# EAGLE design LeoPhiv4 (EAGLE 6.2)
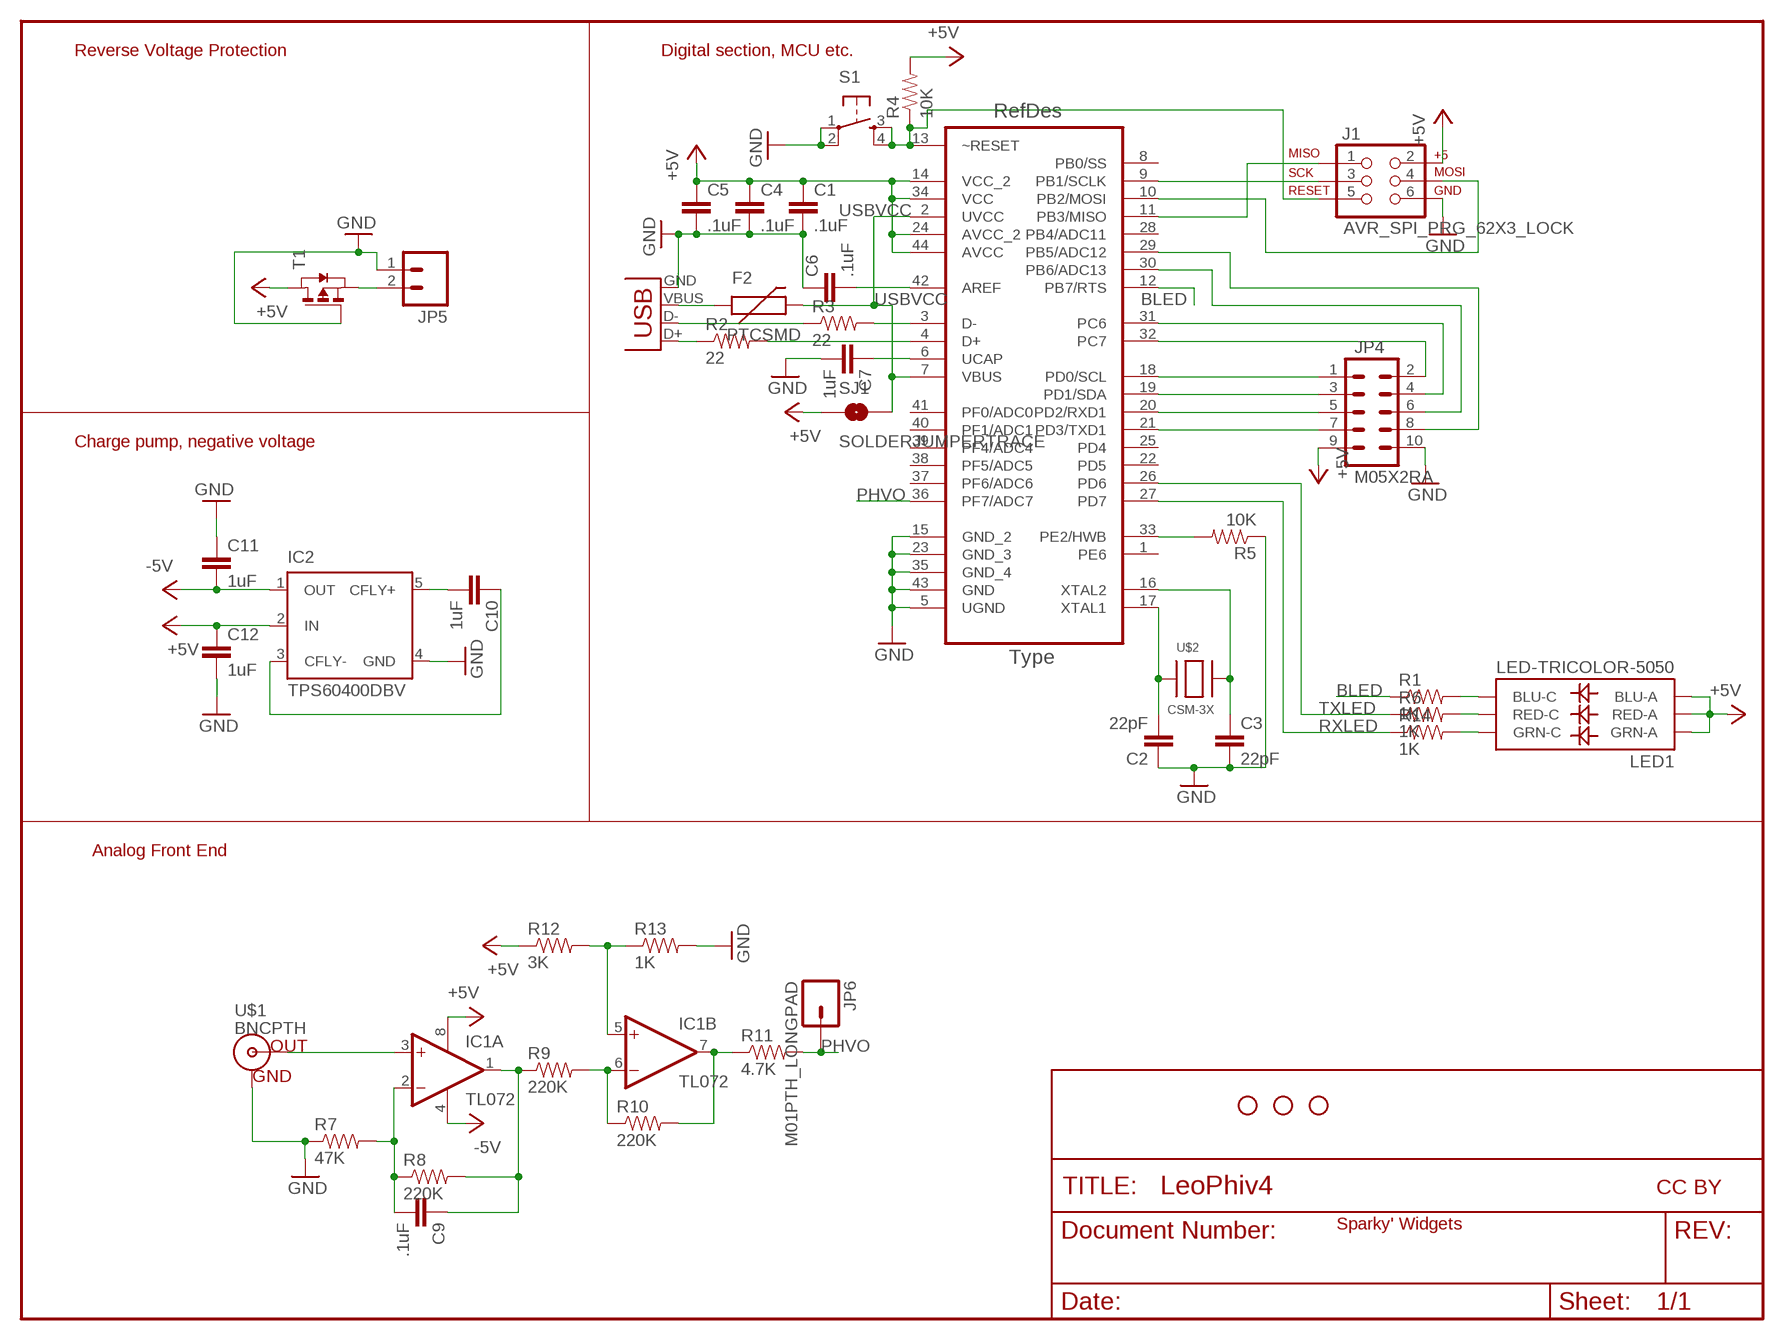
[diagram p0: schematic, sheet 1]

## Parts
C1  .1uF  CAP0805  [0805]
C2  22pF  CAP0805  [0805]
C3  22pF  CAP0805  [0805]
C4  .1uF  CAP0805  [0805]
C5  .1uF  CAP0805  [0805]
C6  .1uF  CAP0805  [0805]
C7  1uF  CAP0805  [0805]
C9  .1uF  CAP0805  [0805]
C10  1uF  CAP0805  [0805]
C11  1uF  CAP0805  [0805]
C12  1uF  CAP0805  [0805]
F2  PTCSMD  [PTC-1206]
IC1  TL072  LM358D  [SO08]
IC2  TPS60400DBV  [SOT23-DBV]
J1  AVR_SPI_PRG_62X3_LOCK  [2X3_LOCK]
JP1  STAND-OFF  [STAND-OFF]
JP2  STAND-OFF  [STAND-OFF]
JP3  STAND-OFF  [STAND-OFF]
JP4  M05X2RA  [2X5-RA]
JP5  M02POLAR  [MOLEX-1X2]
JP6  M01PTH_LONGPAD  [1X01_LONGPAD]
LED1  LED-TRICOLOR-5050  [LED-TRICOLOR-5050]
R1  1K  RESISTOR0805-RES  [0805]
R2  22  RESISTOR0805-RES  [0805]
R3  22  RESISTOR0805-RES  [0805]
R4  10K  RESISTOR0805-RES  [0805]
R5  10K  RESISTOR0805-RES  [0805]
R6  1K  RESISTOR0805-RES  [0805]
R7  47K  RESISTOR0805-RES  [0805]
R8  220K  RESISTOR0805-RES  [0805]
R9  220K  RESISTOR0805-RES  [0805]
R10  220K  RESISTOR0805-RES  [0805]
R11  4.7K  RESISTOR0805-RES  [0805]
R12  3K  RESISTOR0805-RES  [0805]
R13  1K  RESISTOR0805-RES  [0805]
R14  1K  RESISTOR0805-RES  [0805]
S1  TAC_SWITCHSMD  [TACTILE_SWITCH_SMD]
SJ1  SOLDERJUMPERTRACE  [SJ_2S-TRACE]
T1  PMOSSOT23  [SOT-23]
U1  ATMEGA32U4-AU  [QFP80P1200X1200X120-44N]
U$1  BNCPTH  [BNC]
U$2  CSM-3X  [XTALCSM3X]
X1  USBSMD  [USB-MINIB]

## Nets
+5V: C1.1 C4.1 C5.1 C12.1 IC1.8(P:V+) IC2.2(IN) J1.2 JP4.9 LED1.1(GRN-A) LED1.2(RED-A) LED1.3(BLU-A) R4.2 R12.1 SJ1.1 T1.1(D) U1.14(VCC_2) U1.24(AVCC_2) U1.34(VCC) U1.44(AVCC)
-5V: C11.2 IC1.4(P:V-) IC2.1(OUT)
AREF: C6.2 U1.42(AREF)
BLED: R1.1 U1.12(PB7/RTS)
GND: C1.2 C2.1 C3.2 C4.2 C5.2 C6.1 C7.2 C11.1 C12.2 IC2.4(GND) J1.6 JP4.10 JP5.1 R5.1 R7.1 R13.2 S1.1 S1.2 T1.3(G) U1.5(UGND) U1.15(GND_2) U1.23(GND_3) U1.35(GND_4) U1.43(GND) U$1.GND X1.GND
N$1: IC1.5(B:+IN) R12.2 R13.1
N$2: IC1.7(B:OUT) R10.2 R11.1
N$3: IC1.6(B:-IN) R9.2 R10.1
N$4: C2.2 U1.17(XTAL1) U$2.1
N$5: JP4.2 U1.32(PC7)
N$6: C3.1 U1.16(XTAL2) U$2.2
N$7: IC1.3(A:+IN) U$1.S(OUT)
N$8: J1.3 U1.9(PB1/SCLK)
N$9: C9.2 IC1.2(A:-IN) R7.2 R8.1
N$10: C9.1 IC1.1(A:OUT) R8.2 R9.1
N$11: R5.2 U1.33(PE2/HWB)
N$12: JP5.2 T1.2(S)
N$13: R3.1 X1.D-
N$14: R3.2 U1.3(D-)
N$15: R2.1 X1.D+
N$16: R2.2 U1.4(D+)
N$17: C7.1 U1.6(UCAP)
N$18: J1.4 U1.10(PB2/MOSI)
N$19: J1.1 U1.11(PB3/MISO)
N$20: F2.1 X1.VBUS
N$21: J1.5 R4.1 S1.3 S1.4 U1.13(~RESET)
N$22: C10.1 IC2.3(CFLY-)
N$23: C10.2 IC2.5(CFLY+)
N$24: JP4.1 U1.18(PD0/SCL)
N$25: JP4.3 U1.19(PD1/SDA)
N$26: JP4.5 U1.20(PD2/RXD1)
N$27: JP4.7 U1.21(PD3/TXD1)
N$28: JP4.4 U1.31(PC6)
N$29: JP4.6 U1.30(PB6/ADC13)
N$30: JP4.8 U1.29(PB5/ADC12)
N$35: LED1.4(BLU-C) R1.2
N$36: LED1.5(RED-C) R6.2
N$37: LED1.6(GRN-C) R14.2
PHVO: JP6.1 R11.2 U1.36(PF7/ADC7)
RXLED: R14.1 U1.27(PD7)
TXLED: R6.1 U1.26(PD6)
USBVCC: F2.2 SJ1.2 U1.2(UVCC) U1.7(VBUS)
Unconnected: U1.1(PE6) U1.8(PB0/SS) U1.22(PD5) U1.25(PD4) U1.28(PB4/ADC11) U1.37(PF6/ADC6) U1.38(PF5/ADC5) U1.39(PF4/ADC4) U1.40(PF1/ADC1) U1.41(PF0/ADC0)

## Notes on the sheet
- Reverse Voltage Protection | Digital section, MCU etc.
- Charge pump, negative voltage
- Analog Front End
- CC BY
- Sparky' Widgets

## Library data of the parts
C1-C7 C9-C12 = SparkysWidgets:CAP: Capacitor Standard 0603 ceramic capacitor, and 0.1" leaded capacitor.
F2 = SparkysWidgets:PTC: Resettable Fuse PTC Resettable Fuse. Spark Fun Electronics SKU : COM-08357
IC1 = SparkysWidgets:LM358: OP AMP also LM158; LM258; LM2904 Source: http://cache.national.com/ds/LM/LM158.pdf
IC2 = SparkysWidgets:TPS60400DBV: UNREGULATED CHARGE PUMP VOLTAGE INVERTER 60-mA unregultated charge pump voltage inverter Source: http://focus.ti.com/lit/ds/symlink/tps6040i.pdf
J1 = SparkysWidgets:AVR_SPI_PRG_6: AVR ISP 6 Pin Common AVR 6 pin SPI ISP header
JP1-JP3 = SparkFun:STAND-OFF: Stand Off This is the mechanical footprint for a #4 phillips button head screw. Use the keepout ring to avoid running the screw head into surrounding components. SKU : PRT-00447
JP4 = SparkysWidgets:M05X2: Header 5x2 Standard 10-pin dual row 0.1" header.
JP5 = SparkFun:M02: Header 2 Standard 2-pin 0.1" header. Use with straight break away headers (SKU : PRT-00116), right angle break away headers (PRT-00553), swiss pins (PRT-00743), machine pins (PRT-00117), and female headers (PRT-00115). Molex polarized connector foot print use with SKU : PRT-08233 with associated crimp pins and housings.
JP6 = SparkFun:M01: Header 1 Standard 1-pin 0.1" header. Use with straight break away headers (SKU : PRT-00116), right angle break away headers (PRT-00553), swiss pins (PRT-00743), machine pins (PRT-00117), and female headers (PRT-00115).
LED1 = SparkysWidgets:LED-TRICOLOR-5050
R1-R14 = SparkysWidgets:RESISTOR: Resistor Basic schematic elements and footprints for 0603, 1206, and PTH resistors.
S1 = SparkysWidgets:TAC_SWITCH: Momentary Switch Button commonly used for reset or general input. Spark Fun Electronics SKU : COM-00097
SJ1 = SparkFun:SOLDERJUMPER: Solder Jumper Standard SMD solder jumper. Used to automate production. Two varients : Normally Open and Normally Closed are the same, but have different paste layers. NC will have a large amount of paste and should jumper during reflow.
T1 = SparkysWidgets:PMOSSOT23: MOS FET
U1 = SparkysWidgets:ATMEGA32U4-AU; DESCRIPTION: 8-bit Microcontroller with ISP Flash and USB Controller; MPN: ATMEGA32U4-AU; OC_FARNELL: 1748525; OC_NEWARK: 26R5633; PACKAGE: TQFP-44; SUPPLIER: Atmel
U$1 = SparkysWidgets:BNC: BNC Connector, Mouser Part# 5227161
U$2 = SparkysWidgets:CSM-3X: This is an expiremental CSM-3X xtal
X1 = SparkysWidgets:USB: USB Connectors USB-B-PTH is fully proven SKU : PRT-00139 USB-miniB is fully proven SKU : PRT-00587 USB-A-PCB is untested. USB-A-H is throughly reviewed, but untested. Spark Fun Electronics SKU : PRT-00437 USB-B-SMT is throughly reviewed, but untested. Needs silkscreen touching up. USB-A-S has not been used/tested USB-MB-H has not been used/tested

## Board
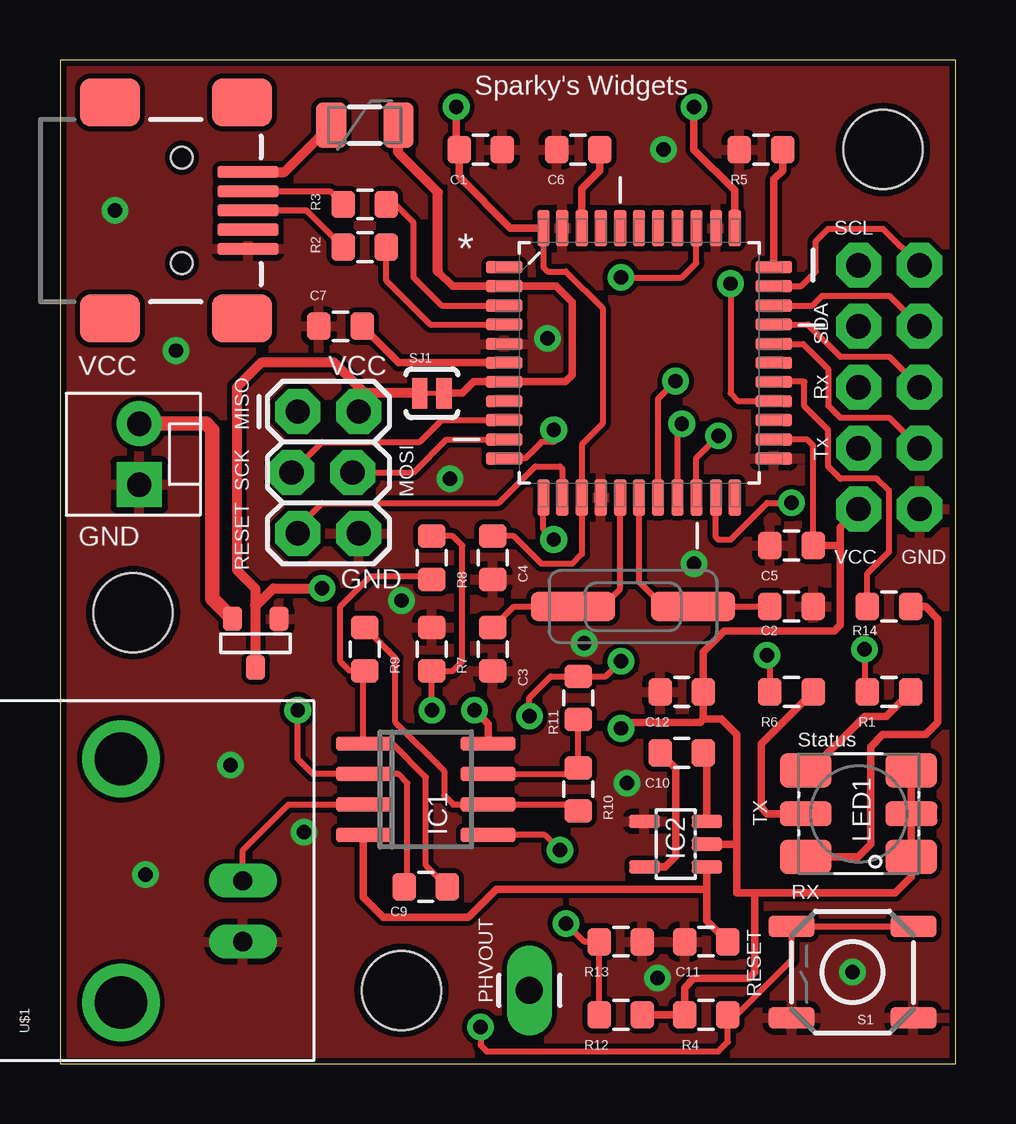
[diagram p1: board, top side]
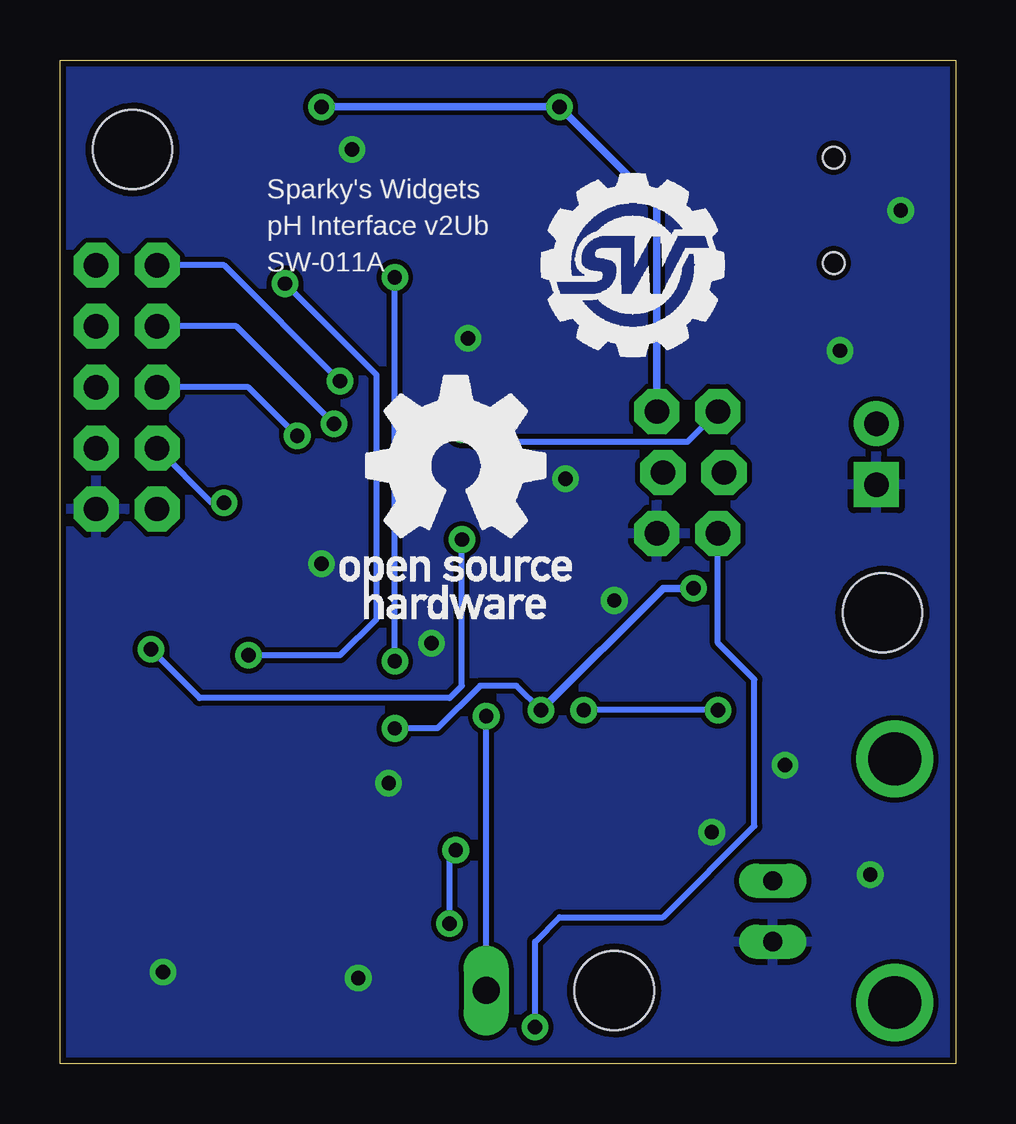
[diagram p2: board, bottom side, seen from below]

Size 37.32 x 41.83 mm. Coordinates in mm from the lower left corner, seen from the top.
Outline: 0,0 37.32,0 37.32,41.83 0,41.83 0,0
Copper layers (1*16): Top 0.035mm / dielectric 1.5mm / Bottom 0.035mm
Design rules: minimum track width 8mil, minimum drill 20mil, track to track 8mil, track to pad 8mil, pad to pad 8mil, via to via 8mil, smd to smd 8mil, copper to edge 10mil, drill to drill 8mil, minimum pad ring 12mil, minimum via ring 10mil, stop-mask expansion 4mil, vias tented up to drill 25mil, thermal gap 10mil

### Footprints (pad centres in the part's own frame; a part is rotated, then mirrored left to right if it is on the bottom)
0805 = smd 0.984 x 1.143: 1 -0.9,0; 2 0.9,0
PTC-1206 = smd 1.27 x 1.905: 1 -1.4,0; 2 1.4,0
SO08 = smd 0.6 x 2.286: 1 -1.905,-2.6; 2 -0.635,-2.6; 3 0.635,-2.6; 4 1.905,-2.6; 5 1.905,2.6; 6 0.635,2.6; 7 -0.635,2.6; 8 -1.905,2.6
SOT23-DBV = smd 0.55 x 1.27: 1 -0.95,-1.3; 2 0,-1.3; 3 0.95,-1.3; 4 0.95,1.3; 5 -0.95,1.3
2X3_LOCK = drill 1.016 pad 1.88 octagon: 1 0,0; 2 0,2.54; 3 2.54,-0.254; 4 2.54,2.286; 5 5.08,0; 6 5.08,2.54
STAND-OFF = hole 3.302: 0,0
2X5-RA = drill 1.016 pad 1.88 octagon: 1 -1.27,5.08; 2 1.27,5.08; 3 -1.27,2.54; 4 1.27,2.54; 5 -1.27,0; 6 1.27,0; 7 -1.27,-2.54; 8 1.27,-2.54; 9 -1.27,-5.08; 10 1.27,-5.08
MOLEX-1X2 = drill 1.016 pad 1.88 square: 1 0,0 | drill 1.016 pad 1.88: 2 2.54,0
1X01_LONGPAD = drill 1.118 pad 1.88 long: 1 0,0
LED-TRICOLOR-5050 = smd 2.159 x 1.448: 1 -2.2,1.8; 3 -2.2,-1.8; 4 2.2,-1.8; 6 2.2,1.8 | smd 2.159 x 1.016: 2 -2.2,0; 5 2.2,0
TACTILE_SWITCH_SMD = smd 1.905 x 0.889: 1 -2.54,1.905; 2 2.54,1.905; 3 -2.54,-1.905; 4 2.54,-1.905
SJ_2S-TRACE = smd 0.635 x 1.27: 1 -0.508,0; 2 0.508,0
SOT-23 = smd 0.787 x 1.016: 1 0.025,-1.016; 2 -0.94,1.016; 3 0.991,1.016
QFP80P1200X1200X120-44N = smd 1.524 x 0.508: 1 -5.613,3.988; 2 -5.613,3.2; 3 -5.613,2.388; 4 -5.613,1.6; 5 -5.613,0.787; 6 -5.613,0; 7 -5.613,-0.787; 8 -5.613,-1.6; 9 -5.613,-2.388; 10 -5.613,-3.2; 11 -5.613,-3.988; 23 5.613,-3.988; 24 5.613,-3.2; 25 5.613,-2.388; 26 5.613,-1.6; 27 5.613,-0.787; 28 5.613,0; 29 5.613,0.787; 30 5.613,1.6; 31 5.613,2.388; 32 5.613,3.2; 33 5.613,3.988 | smd 0.508 x 1.524: 12 -3.988,-5.613; 13 -3.2,-5.613; 14 -2.388,-5.613; 15 -1.6,-5.613; 16 -0.787,-5.613; 17 0,-5.613; 18 0.787,-5.613; 19 1.6,-5.613; 20 2.388,-5.613; 21 3.2,-5.613; 22 3.988,-5.613; 34 3.988,5.613; 35 3.2,5.613; 36 2.388,5.613; 37 1.6,5.613; 38 0.787,5.613; 39 0,5.613; 40 -0.787,5.613; 41 -1.6,5.613; 42 -2.388,5.613; 43 -3.2,5.613; 44 -3.988,5.613
BNC = drill 2.2: 3 -5.08,5.08; 4 5.08,5.08 | drill 0.8 long: GND -2.54,0; S 0,0
XTALCSM3X = smd 3.5 x 1.2: 1 -2.5,0; 2 2.5,0
USB-MINIB = smd 2.54 x 0.5: D+ 2.754,0; D- 2.754,0.8; GND 2.754,-1.6; ID 2.754,-0.8; VBUS 2.754,1.6 | smd 2.515 x 2.007: MTN1 -3,4.5; MTN2 2.5,4.5; MTN3 -3,-4.5; MTN4 2.5,-4.5 | hole 0.9: 0,2.2; 0,-2.2

### Placement (x,y rotation side)
C1  17.53,38.1 0 top
C2  30.48,19.05 180 top
C3  18.03,17.27 270 top
C4  18.03,21.08 270 top
C5  30.48,21.59 180 top
C6  21.59,38.1 0 top
C7  11.68,30.73 180 top
C9  15.24,7.37 180 top
C10  25.91,12.95 180 top
C11  26.92,5.08 0 top
C12  25.91,15.49 180 top
F2  12.7,39.12 0 top
IC1  15.24,11.43 270 top
IC2  25.65,9.14 90 top
J1  9.91,27.18 270 top
JP1  3.05,18.8 0 top
JP2  14.22,3.05 0 top
JP3  34.29,38.1 0 top
JP4  34.54,28.19 0 top
JP5  3.3,24.13 90 top
JP6  19.56,3.05 180 top
LED1  33.27,10.41 180 top
R1  34.54,15.49 0 top
R2  12.7,34.04 0 top
R3  12.7,35.81 0 top
R4  26.92,2.03 180 top
R5  29.21,38.1 0 top
R6  30.48,15.49 0 top
R7  15.49,17.27 270 top
R8  15.49,21.08 270 top
R9  12.7,17.27 90 top
R10  21.59,11.43 90 top
R11  21.59,15.24 90 top
R12  23.37,2.03 180 top
R13  23.37,5.08 0 top
R14  34.54,19.05 0 top
S1  33.02,3.81 180 top
SJ1  15.49,27.94 0 top
T1  8.13,17.53 0 top
U1  24.13,29.21 0 top
U$1  7.62,7.62 90 top
U$2  23.88,19.05 180 top
U$3  [SWPCBLOGOMED]  17.27,29.46 0 bottom
U$4  [OSHWLOGO]  25.65,18.54 0 bottom
X1  5.08,35.56 0 top

### Tracks (layer width: path | path; a pad name or v marks a point on that pad's centre or on a via)
+5V  (via drill 0.6)
  Top 0.254: v23.37,13.97 23.62,13.97 23.88,14.22 | C5.1 31.38,25.77 31.14,26.01 U1.24 | C4.1 18.91,21.98 20.07,20.83 21.34,20.83 21.74,21.23 U1.14 21.74,25.81 22.61,26.67 22.61,31.5 21.08,33.02 20.32,33.02 20.14,33.2 U1.44
  Top 0.305: 23.88,14.22 26.67,14.22 26.81,14.36 | 26.81,14.36 C12.1 26.81,17.16 27.69,18.03 32.26,18.03 32.51,18.29 32.51,21.59 | 26.81,14.36 27.55,14.36 28.19,13.72 28.19,9.14 | 28.19,9.14 IC2.2 | 28.19,9.14 28.19,7.11 28.96,7.11 | 28.96,7.11 34.8,7.11 35.47,7.79 LED1.1 LED1.2 LED1.3 | R12.1 R4.2 26.02,3.16 26.42,3.56 28.7,3.56 28.96,3.81 28.96,7.11 | IC1.8 17.84,14.16 v17.27,14.73 | U1.44 18.77,34.82 16.63,36.97 C1.1 16.51,38.22 v16.51,39.88 | v26.42,39.88 26.42,38.1 28.12,36.4 U1.34 | 32.51,21.59 32.51,22.35 JP4.9 | 32.51,21.59 C5.1
  Top 0.406: T1.1 8.15,19.07 | 8.15,19.07 8.89,19.81 v10.92,19.81 | SJ1.1 12.7,27.94 | 12.7,27.94 11.43,29.21 8.38,29.21 7.37,28.19 7.37,20.57 8.13,19.81 8.13,19.1 8.15,19.07 | J1.2 12.45,27.69 12.7,27.94
  Bottom 0.254: v17.27,14.73 18.29,15.75 19.81,15.75 21.59,13.97 v23.37,13.97
  Bottom 0.305: v17.27,14.73 12.19,19.81 v10.92,19.81 | J1.2 12.45,35.81 v16.51,39.88 v26.42,39.88
-5V
  Top 0.305: 26.95,7.25 26.95,5.95 C11.2 | 26.95,7.25 IC2.1 | 26.95,7.25 18.18,7.25 17.02,6.1 13.46,6.1 12.64,6.92 IC1.4
AREF
  Top 0.305: U1.42 21.74,36.47 22.49,37.22 C6.2
BLED  (via drill 0.6)
  Top 0.254: U1.12 20.14,22.28 v20.57,21.84 | v33.53,17.27 33.53,15.61 R1.1
  Bottom 0.254: v20.57,21.84 20.57,15.75 21.08,15.24 31.5,15.24 v33.53,17.27
GND  (via drill 0.6)
  other vias: 2.29,35.56 4.83,29.72 20.32,30.23 25.15,38.1 3.56,7.87 7.11,12.45 16.26,24.38 24.89,3.56 14.22,19.3 23.62,11.68 21.84,17.53 26.42,20.83 10.16,9.65 33.02,3.81
  pour Top: -1.02,-0.51 -1.02,42.42 38.1,42.42 38.1,-0.25 38.1,-0.51
  pour Bottom: -1.78,43.18 -1.78,-1.52 39.12,-1.52 39.12,-0.76 39.12,43.18
N$1  (via drill 0.6)
  Top 0.254: R12.2 R13.1 21.84,5.08 v21.08,5.84 | IC1.5 20.19,9.53 v20.83,8.89
  Bottom 0.254: v21.08,5.84 21.08,8.64 v20.83,8.89
N$2
  Top 0.254: IC1.7 21.32,12.06 R10.2 R11.1
N$3
  Top 0.254: R10.1 21.32,10.79 IC1.6 16.38,10.79 16,11.18 16,12.19 13.97,14.22 13.97,16.9 R9.2
N$4
  Top 0.254: U1.17 24.13,20.07 25.15,19.05 U$2.1 C2.2
N$5
  Top 0.254: U1.32 30.89,32.41 31.5,33.02 31.5,34.29 32,34.8 34.29,34.8 JP4.2
N$6
  Top 0.254: U1.16 23.34,19.79 22.61,19.05 U$2.2 18.91,19.05 C3.1
N$7
  Top 0.254: U$1.S 7.62,8.89 9.53,10.79 IC1.3
N$8
  Top 0.254: J1.3 10.92,25.91 14.99,25.91 15.9,26.82 U1.9
N$9  (via drill 0.6)
  Top 0.254: C9.2 14.48,7.5 14.48,11.68 14.1,12.06 IC1.2 10.54,12.06 9.91,12.7 v9.91,14.73 | v15.49,14.73 R7.2 16.37,16.37 16.76,16.76 16.76,21.59 16.37,21.98 R8.1
  Bottom 0.254: v9.91,14.73 v15.49,14.73
N$10
  Top 0.254: C9.1 15.24,8.27 15.24,11.94 13.84,13.34 IC1.1 12.64,16.31 R9.1 12.08,16.37 11.68,16.76 11.68,19.05 12.95,20.32 15.36,20.32 R8.2
N$11
  Top 0.305: U1.33 29.74,36.85 30.11,37.22 R5.2
N$12
  Top 0.61: JP5.2 6.1,26.67 6.35,26.42 6.35,19.38 T1.2
N$13
  Top 0.254: X1.D- 11.25,36.36 R3.1
N$14
  Top 0.254: R3.2 13.97,35.81 14.73,35.05 14.73,32.77 15.9,31.6 U1.3
N$15
  Top 0.254: X1.D+ 10.28,35.56 R2.1
N$16
  Top 0.254: R2.2 13.6,32.63 15.42,30.81 U1.4
N$17
  Top 0.305: U1.6 14.11,29.21 C7.1
N$18
  Top 0.254: U1.10 16.1,26.01 14.73,24.64 J1.4
N$19  (via drill 0.6)
  Top 0.254: v20.57,26.42 20.57,25.91 20.07,25.91 19.38,25.22 U1.11
  Bottom 0.254: J1.1 11.18,25.91 20.07,25.91 v20.57,26.42
N$20
  Top 0.406: X1.VBUS 9.34,37.16 F2.1
N$21  (via drill 0.6)
  Top 0.254: J1.5 9.91,22.35 10.92,23.37 18.29,23.37 19.81,24.89 20.83,24.89 20.93,24.79 U1.13 | S1.3 S1.4 30.48,4.32 28.19,2.03 R4.1 27.82,0.9 27.43,0.51 17.78,0.51 17.53,0.76 v17.53,1.52
  Bottom 0.254: J1.5 9.91,17.53 8.38,16 8.38,9.91 12.19,6.1 16.51,6.1 17.53,5.08 v17.53,1.52
N$22
  Top 0.305: IC2.3 26.95,12.81 C10.1
N$23
  Top 0.305: IC2.5 25.21,8.19 25.65,8.64 25.65,12.31 C10.2
N$24  (via drill 0.6)
  Top 0.254: U1.18 24.92,27.71 v25.65,28.45
  Bottom 0.254: v25.65,28.45 30.48,33.27 JP4.1
N$25  (via drill 0.6)
  Top 0.254: U1.19 25.73,26.49 v25.91,26.67
  Bottom 0.254: v25.91,26.67 29.97,30.73 JP4.3
N$26  (via drill 0.6)
  Top 0.254: U1.20 26.52,25.25 v27.43,26.16
  Bottom 0.254: v27.43,26.16 29.46,28.19 JP4.5
N$27  (via drill 0.6)
  Top 0.254: U1.21 27.33,21.95 27.43,21.84 27.94,21.84 29.46,23.37 v30.48,23.37
  Bottom 0.254: v30.48,23.37 30.99,23.37 JP4.7
N$28
  Top 0.254: U1.31 31.34,31.6 31.75,32 34.54,32 JP4.4
N$29
  Top 0.254: U1.30 31.17,30.81 32.51,29.46 34.54,29.46 JP4.6
N$30
  Top 0.254: U1.29 30.96,30 32,28.96 32,27.43 32.51,26.92 34.54,26.92 JP4.8
N$35
  Top 0.305: LED1.4 31.26,12.21 33.53,14.48 34.43,14.48 R1.2
N$36
  Top 0.305: LED1.5 29.46,10.41 29.21,10.67 29.21,13.32 R6.2
N$37
  Top 0.305: LED1.6 33.25,8.61 33.78,9.14 33.78,13.21 34.29,13.72 36.07,13.72 36.58,14.22 36.58,18.54 36.07,19.05 R14.2
PHVO  (via drill 0.6)
  Top 0.254: v23.37,16.76 22.74,16.14 R11.2 20.46,16.14 19.56,15.24 v19.56,14.48 | v23.37,32.77 25.91,32.77 26.52,33.38 U1.36
  Bottom 0.254: v23.37,16.76 v23.37,32.77 | JP6.1 v19.56,14.48
RXLED
  Top 0.254: U1.27 31.01,28.42 31.01,27.41 32,26.42 32,24.89 32.51,24.38 34.04,24.38 34.54,23.88 34.54,21.34 33.64,20.44 R14.1
TXLED  (via drill 0.6)
  Top 0.254: R6.1 29.58,16.9 v29.46,17.02 | v27.94,32.51 27.94,27.94 28.27,27.61 U1.26
  Bottom 0.254: v29.46,17.02 25.65,17.02 24.13,18.54 24.13,28.7 v27.94,32.51
USBVCC
  Top 0.305: 15.75,33.02 16.36,32.41 U1.2 20.68,32.41 21.34,31.75 21.34,28.7 21.06,28.42 U1.7 17.25,28.42 16.76,27.94 SJ1.2
  Top 0.406: 14.1,38.73 F2.2 14.1,37.97 15.75,36.32 15.75,33.02

### Text on the board
tPlace: Sparky's Widgets | SCL | SDA | VCC | VCC | Rx | MISO | Tx | SCK | MOSI | GND | RESET | VCC | GND | GND | Status | TX | RX | PHVOUT | RESET
bPlace: Sparky's Widgets | pH Interface v2Ub | SW-011A